# EAGLE design sc_v0 (EAGLE 6.0)
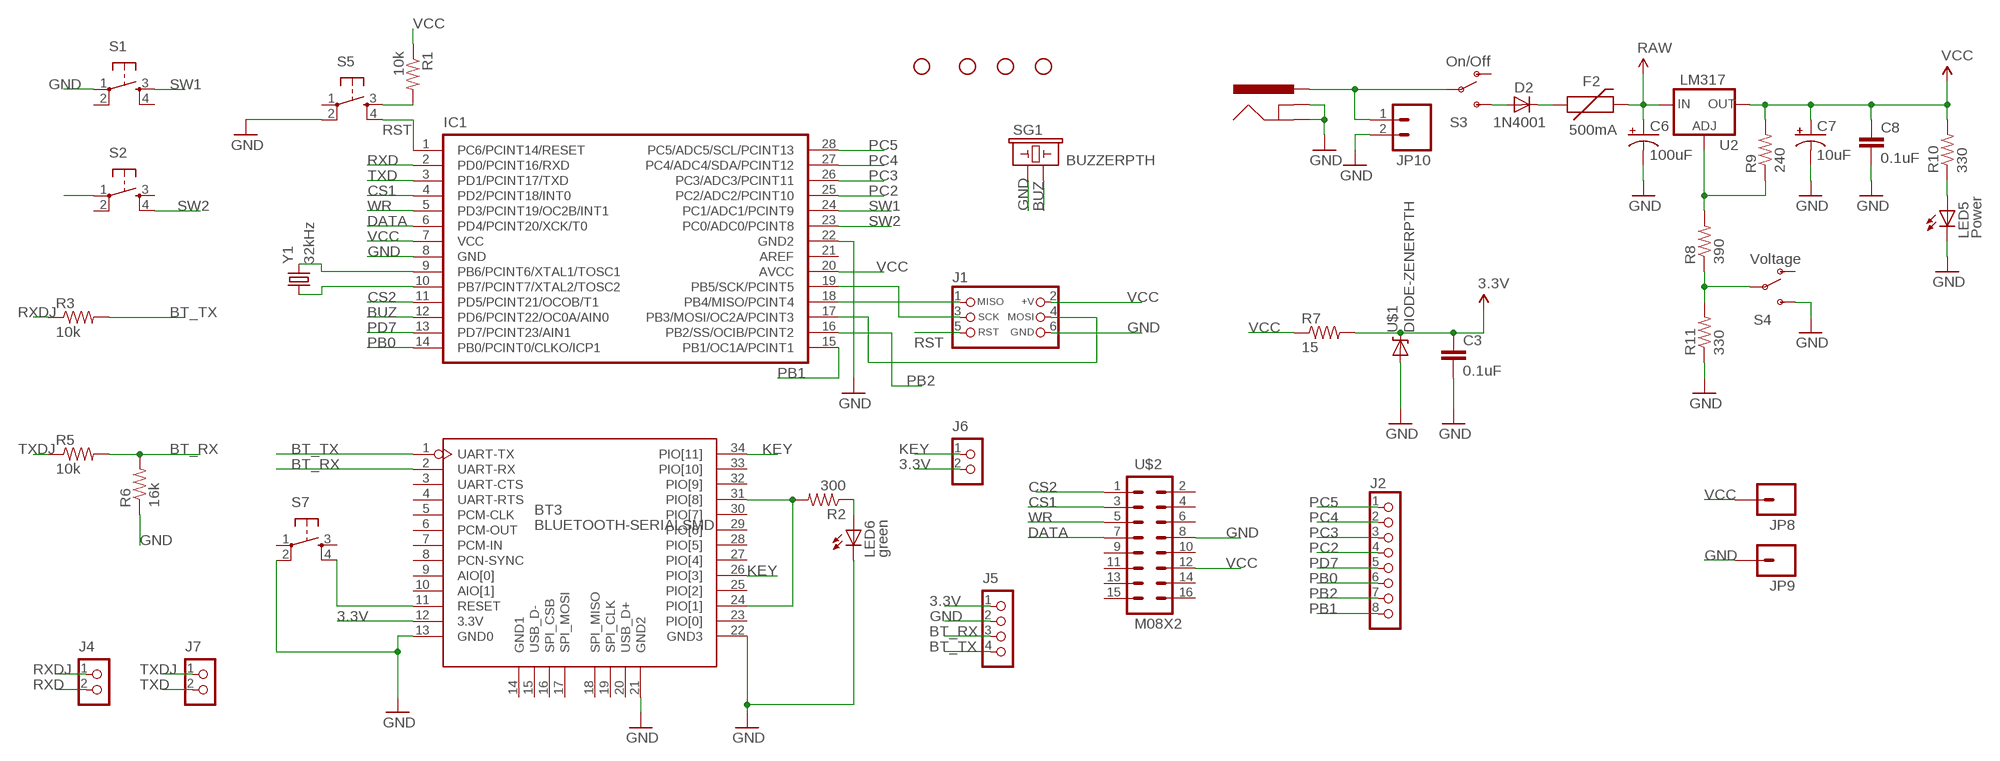
[diagram p0: schematic, sheet 1]

## Parts
BT3  BLUETOOTH-SERIALSMD  [SERIAL_BLUETEETH]
C3  0.1uF  CAPPTH2  [CAP-PTH-SMALL2]
C6  100uF  CAP_POLPTH1  [CPOL-RADIAL-100UF-25V]
C7  10uF  CAP_POLPTH2  [CPOL-RADIAL-10UF-25V]
C8  0.1uF  CAPPTH2  [CAP-PTH-SMALL2]
D2  1N4001  DIODEPTH  [DIODE-0.4]
F2  500mA  PTCPTH  [PTC]
IC1  IC_UC_ATMEGA328PDIL  [DIL28-N]
J1  CON_HEADER_PRG_AVR_ICSP  [HEADER_PRG_2X03]
J2  CON_HEADER_1X08-PTH  [M1X8]
J3  POWER_JACKPTH  [POWER_JACK_PTH]
J4  CON_HEADER_1X02-PTH  [M1X2]
J5  CON_HEADER_1X04  [M1X4]
J6  CON_HEADER_1X02-PTH  [M1X2]
J7  CON_HEADER_1X02-PTH  [M1X2]
JP1  STAND-OFF  [STAND-OFF]
JP2  STAND-OFF  [STAND-OFF]
JP3  STAND-OFF  [STAND-OFF]
JP4  STAND-OFF  [STAND-OFF]
JP8  M01PTH  [1X01]
JP9  M01PTH  [1X01]
JP10  M02PTH  [1X02]
LED5  Power  LED5MM  [LED5MM]
LED6  green  LED3MM  [LED3MM]
R1  10k  RESISTORAXIAL-0.3  [AXIAL-0.3]
R2  300  RESISTORAXIAL-0.3  [AXIAL-0.3]
R3  10k  RESISTORAXIAL-0.3  [AXIAL-0.3]
R5  10k  RESISTORAXIAL-0.3  [AXIAL-0.3]
R6  16k  RESISTORAXIAL-0.3  [AXIAL-0.3]
R7  15  RESISTORAXIAL-0.3  [AXIAL-0.3]
R8  390  RESISTORAXIAL-0.3  [AXIAL-0.3]
R9  240  RESISTORAXIAL-0.3  [AXIAL-0.3]
R10  330  RESISTORAXIAL-0.3  [AXIAL-0.3]
R11  330  RESISTORAXIAL-0.3  [AXIAL-0.3]
S1  TAC_SWITCHPTH  [TACTILE-PTH]
S2  TAC_SWITCHPTH  [TACTILE-PTH]
S3  On/Off  SWITCH-SPSTPTH  [SWITCH-SPST]
S4  Voltage  SWITCH-SPSTPTH  [SWITCH-SPST]
S5  TAC_SWITCHPTH  [TACTILE-PTH]
S7  TAC_SWITCHPTH  [TACTILE-PTH]
SG1  BUZZERPTH  [BUZZER-12MM]
U2  LM317  V_REG_317SINK  [TO220-ADJ]
U$1  DIODE-ZENERPTH  [DIODE-ZENER]
U$2  M08X2  [2X8]
Y1  32kHz  CRYSTALTC38H  [TC38H]

## Nets
3.3V: BT3.12(3.3V) C3.1 J5.1 J6.2 R7.P$2 U$1.P$1(C)
BT_RX: BT3.2(UART-RX) J5.3 R5.P$2 R6.P$2
BT_TX: BT3.1(UART-TX) J5.4 R3.P$2
BUZ: IC1.12(PD6/PCINT22/OC0A/AIN0) SG1.-
CS1: IC1.4(PD2/PCINT18/INT0) U$2.3
CS2: IC1.11(PD5/PCINT21/OCOB/T1) U$2.1
DATA: IC1.6(PD4/PCINT20/XCK/T0) U$2.7
GND: BT3.13(GND0) BT3.21(GND2) BT3.22(GND3) C3.2 C6.2(-) C7.2(-) C8.2 IC1.8(GND) IC1.22(GND2) J1.6(GND) J3.GND J3.GNDBREAK J5.2 JP9.1 JP10.2 LED5.K(C) LED6.K(C) R6.P$1 R11.P$1 S1.1 S2.1 S4.3(S) S5.2 S7.2 SG1.+ U$1.P$2(A) U$2.8
KEY: BT3.26(PIO[3]) BT3.34(PIO[11]) J6.1
N$1: IC1.9(PB6/PCINT6/XTAL1/TOSC1) Y1.2
N$2: IC1.10(PB7/PCINT7/XTAL2/TOSC2) Y1.1
N$3: IC1.18(PB4/MISO/PCINT4) J1.1(MISO)
N$4: IC1.19(PB5/SCK/PCINT5) J1.3(SCK)
N$5: IC1.17(PB3/MOSI/OC2A/PCINT3) J1.4(MOSI)
N$6: R8.P$2 R9.P$1 U2.ADJ
N$7: LED5.A R10.P$1
N$8: BT3.24(PIO[1]) BT3.31(PIO[8]) R2.P$2
N$9: D2.C F2.P$1
N$10: D2.A S3.3(S)
N$11: J3.PWR JP10.1 S3.2(P)
N$12: R8.P$1 R11.P$2 S4.2(P)
N$14: R1.P$2 S5.3
N$20: BT3.11(RESET) S7.4
N$22: LED6.A R2.P$1
PB0: IC1.14(PB0/PCINT0/CLKO/ICP1) J2.6
PB1: IC1.15(PB1/OC1A/PCINT1) J2.8
PB2: IC1.16(PB2/SS/OCIB/PCINT2) J2.7
PC2: IC1.25(PC2/ADC2/PCINT10) J2.4
PC3: IC1.26(PC3/ADC3/PCINT11) J2.3
PC4: IC1.27(PC4/ADC4/SDA/PCINT12) J2.2
PC5: IC1.28(PC5/ADC5/SCL/PCINT13) J2.1
PD7: IC1.13(PD7/PCINT23/AIN1) J2.5
RAW: C6.1(+) F2.P$2 U2.IN
RST: IC1.1(PC6/PCINT14/RESET) J1.5(RST) S5.4
RXD: IC1.2(PD0/PCINT16/RXD) J4.2
RXDJ: J4.1 R3.P$1
SW1: IC1.24(PC1/ADC1/PCINT9) S1.3
SW2: IC1.23(PC0/ADC0/PCINT8) S2.4
TXD: IC1.3(PD1/PCINT17/TXD) J7.2
TXDJ: J7.1 R5.P$1
VCC: C7.1(+) C8.1 IC1.7(VCC) IC1.20(AVCC) J1.2(+V) JP8.1 R1.P$1 R7.P$1 R9.P$2 R10.P$2 U2.OUT U$2.12
WR: IC1.5(PD3/PCINT19/OC2B/INT1) U$2.5
Unconnected: BT3.3(UART-CTS) BT3.4(UART-RTS) BT3.5(PCM-CLK) BT3.6(PCM-OUT) BT3.7(PCM-IN) BT3.8(PCN-SYNC) BT3.9(AIO[0]) BT3.10(AIO[1]) BT3.14(GND1) BT3.15(USB_D-) BT3.16(SPI_CSB) BT3.17(SPI_MOSI) BT3.18(SPI_MISO) BT3.19(SPI_CLK) BT3.20(USB_D+) BT3.23(PIO[0]) BT3.25(PIO[2]) BT3.27(PIO[4]) BT3.28(PIO[5]) BT3.29(PIO[6]) BT3.30(PIO[7]) BT3.32(PIO[9]) BT3.33(PIO[10]) IC1.21(AREF) S1.2 S1.4 S2.2 S2.3 S3.1(O) S4.1(O) S5.1 S7.1 S7.3 U$2.2 U$2.4 U$2.6 U$2.9 U$2.10 U$2.11 U$2.13 U$2.14 U$2.15 U$2.16

## Library data of the parts
BT3 = Module:BLUETOOTH-SERIAL
C3 C8 = SparkFun:CAP: Capacitor Standard 0603 ceramic capacitor, and 0.1" leaded capacitor.
C6 C7 = SparkFun:CAP_POL: Capacitor Polarized These are standard SMD and PTH capacitors. Normally 10uF, 47uF, and 100uF in electrolytic and tantalum varieties. Always verify the external diameter of the through hole cap, it varies with capacity, voltage, and manufacturer. The EIA devices should be standard.
D2 = SparkFun:DIODE: Diode These are standard reverse protection diodes and small signal diodes. SMA package can handle up to about 1A. SOD-323 can handle about 200mA. What the SOD-323 package when ordering, there are some mfgs out there that are 5-pin packages.
F2 = SparkFun:PTC: Resettable Fuse PTC Resettable Fuse. Spark Fun Electronics SKU : COM-08357
IC1 = dp_devices:IC_UC_ATMEGA328P
J1 = dp_devices:CON_HEADER_PRG_AVR_ICSP: 2x3 AVR ICSP programming header
J2 = dp_devices:CON_HEADER_1X08
J3 = SparkFun:POWER_JACK: Power Jack This is the standard 5.5mm barrel jack for power. The PTH is the most common, proven, reliable, footprint. All others are experimental. The Slot footprint only works if the mill layer is transmitted to the PCB fab house so be warned. Spark Fun Electronics SKU : PRT-00119. Mating wall wart : TOL-00298 (and others)
J4 J6 J7 = dp_devices:CON_HEADER_1X02
J5 = dp_devices:CON_HEADER_1X04
JP1-JP4 = SparkFun:STAND-OFF: Stand Off This is the mechanical footprint for a #4 phillips button head screw. Use the keepout ring to avoid running the screw head into surrounding components. SKU : PRT-00447
JP8 JP9 = SparkFun:M01: Header 1 Standard 1-pin 0.1" header. Use with straight break away headers (SKU : PRT-00116), right angle break away headers (PRT-00553), swiss pins (PRT-00743), machine pins (PRT-00117), and female headers (PRT-00115).
JP10 = SparkFun:M02: Header 2 Standard 2-pin 0.1" header. Use with straight break away headers (SKU : PRT-00116), right angle break away headers (PRT-00553), swiss pins (PRT-00743), machine pins (PRT-00117), and female headers (PRT-00115). Molex polarized connector foot print use with SKU : PRT-08233 with associated crimp pins and housings.
LED5 = SparkFun-Nate:LED
LED6 = SparkFun:LED: LEDs Standard schematic elements and footprints for 5mm, 3mm, 1206, and 0603 sized LEDs. 5mm - Spark Fun Electronics SKU : COM-00529 (and others)
R1-R3 R5-R11 = SparkFun:RESISTOR: Resistor Basic schematic elements and footprints for 0603, 1206, and PTH resistors.
S1 S2 S5 S7 = SparkFun:TAC_SWITCH: Momentary Switch Button commonly used for reset or general input. Spark Fun Electronics SKU : COM-00097
S3 S4 = SparkFun:SWITCH-SPST: SPST Switch Simple slide switch. Spark Fun Electronics SKU : COM-00102
SG1 = SparkFun:BUZZER: Buzzer 12mm Spark Fun Electronics SKU : Comp-Buzzer
U2 = SparkFun:V_REG_317: Voltage Regulator Standard LM317 adjustable voltage regulator. AOI (Adjust Output Input). Google 'LM317 Calculator' for easy to use app to get the two resistor values needed. 240/720 for 5V output. 240/390 for 3.3V output. Spark Fun Electronics SKU : COM-00527
U$1 = SparkFun:DIODE-ZENER: Zener Diode Production Part - 8199 3.4V Zener Voltage
U$2 = SparkFun:M08X2
Y1 = SparkFun:CRYSTAL: Crystals Various standard crystals. Proven footprints. Spark Fun Electronics SKU : COM-00534

## Net classes
0 default: width 0.003 mm, drill 0.254 mm, clearance 0.152 mm

## Board
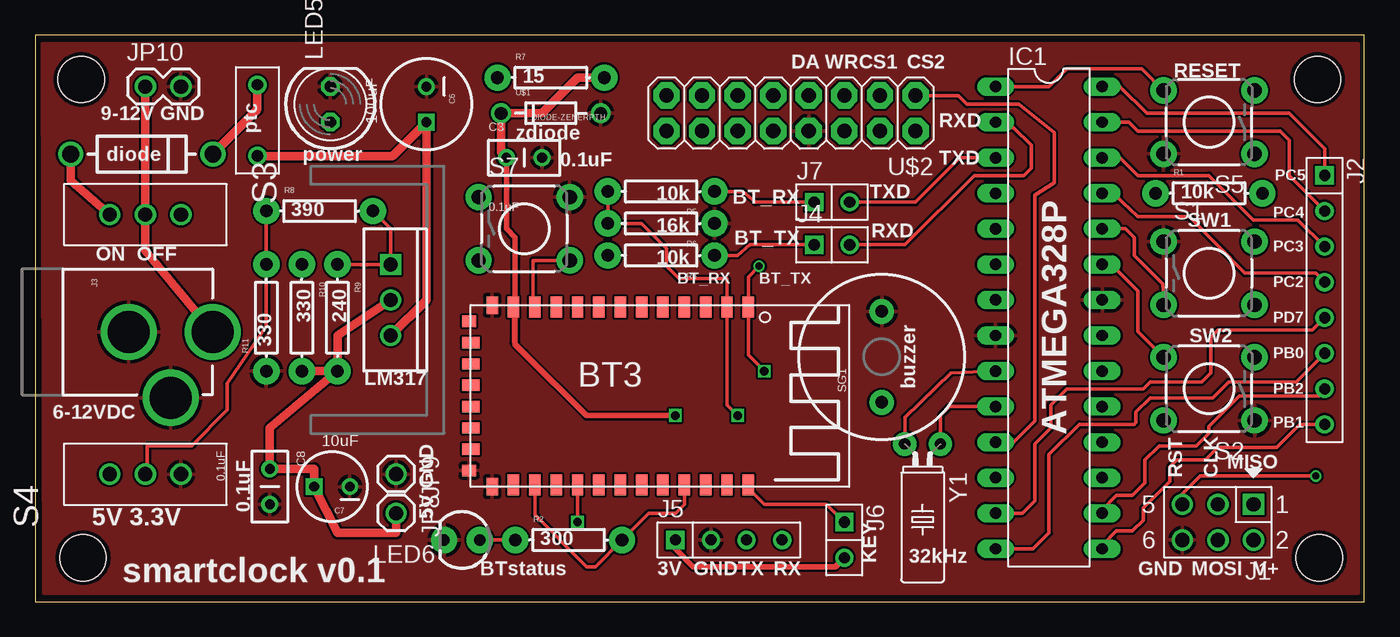
[diagram p1: board, top side]
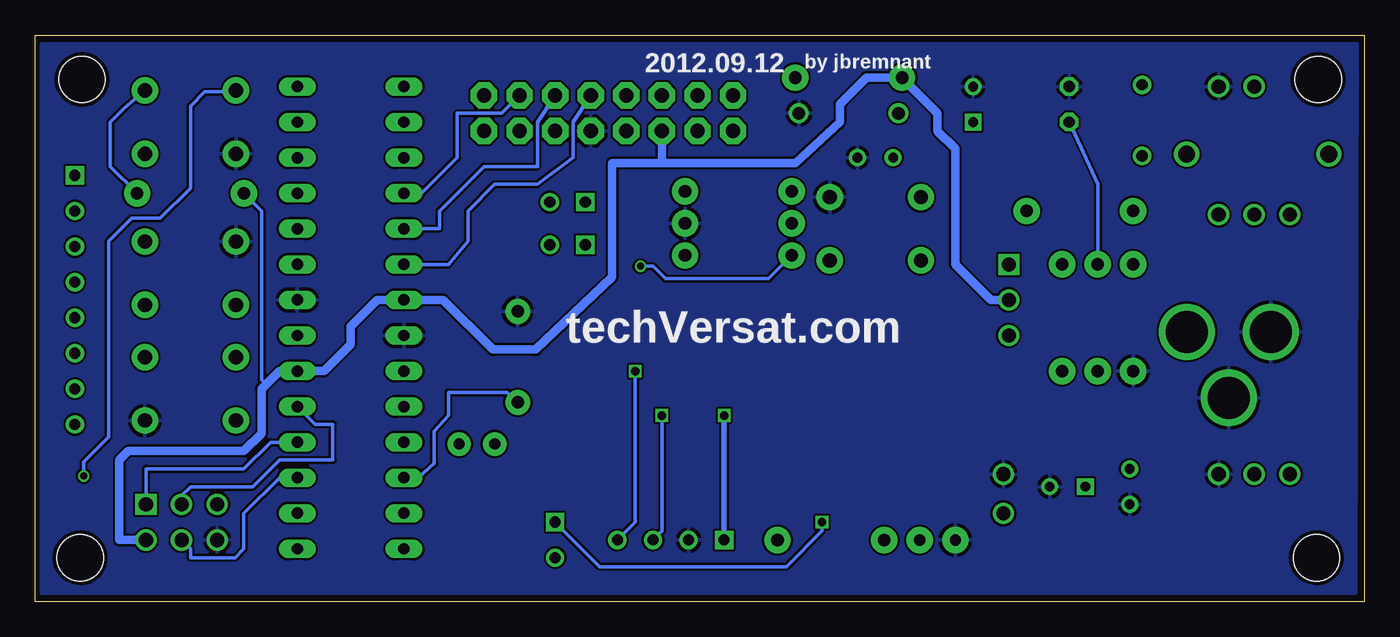
[diagram p2: board, bottom side, seen from below]

Size 94.92 x 40.49 mm. Coordinates in mm from the lower left corner, seen from the top.
Outline: 0,40.49 0,0 94.92,0 94.92,40.49 0,40.49
Copper layers (1*16): Top 0.035mm / dielectric 1.5mm / Bottom 0.035mm
Design rules: minimum track width 6mil, minimum drill 12mil, track to track 6mil, track to pad 6mil, pad to pad 6mil, via to via 6mil, smd to smd 0mil, copper to edge 10mil, drill to drill 10mil, minimum pad ring 10mil, minimum via ring 6mil, stop-mask expansion 2mil, vias tented up to drill 100mil, thermal gap 10mil

### Footprints (pad centres in the part's own frame; a part is rotated, then mirrored left to right if it is on the bottom)
SERIAL_BLUETEETH = smd 1.524 x 0.813: 1 -6.35,19.812; 2 -6.35,18.288; 3 -6.35,16.764; 4 -6.35,15.24; 5 -6.35,13.716; 6 -6.35,12.192; 7 -6.35,10.668; 8 -6.35,9.144; 9 -6.35,7.62; 10 -6.35,6.096; 11 -6.35,4.572; 12 -6.35,3.048; 23 6.35,3.048; 24 6.35,4.572; 25 6.35,6.096; 26 6.35,7.62; 27 6.35,9.144; 28 6.35,10.668; 29 6.35,12.192; 30 6.35,13.716; 31 6.35,15.24; 32 6.35,16.764; 33 6.35,18.288; 34 6.35,19.812 | smd 1.27 x 0.813: 13 -6.477,1.524; 22 6.477,1.524 | smd 0.813 x 1.016: 14 -5.334,-0.127; 21 5.334,-0.127 | smd 0.813 x 1.27: 15 -3.81,0; 16 -2.286,0; 17 -0.762,0; 18 0.762,0; 19 2.286,0; 20 3.81,0
CAP-PTH-SMALL2 = drill 0.7: 1 0,0; 2 2.54,0
CPOL-RADIAL-100UF-25V = drill 0.7 square: 1 1.27,0 | drill 0.7: 2 -1.27,0
CPOL-RADIAL-10UF-25V = drill 0.7 square: 1 1.27,0 | drill 0.7: 2 -1.27,0
DIODE-0.4 = drill 1.2: A 0,0; C 10.16,0
PTC = drill 0.8: P$1 -2.54,0; P$2 2.54,0
DIL28-N = drill 0.813 long: 1 -16.51,-3.81; 2 -13.97,-3.81; 3 -11.43,-3.81; 4 -8.89,-3.81; 5 -6.35,-3.81; 6 -3.81,-3.81; 7 -1.27,-3.81; 8 1.27,-3.81; 9 3.81,-3.81; 10 6.35,-3.81; 11 8.89,-3.81; 12 11.43,-3.81; 13 13.97,-3.81; 14 16.51,-3.81; 15 16.51,3.81; 16 13.97,3.81; 17 11.43,3.81; 18 8.89,3.81; 19 6.35,3.81; 20 3.81,3.81; 21 1.27,3.81; 22 -1.27,3.81; 23 -3.81,3.81; 24 -6.35,3.81; 25 -8.89,3.81; 26 -11.43,3.81; 27 -13.97,3.81; 28 -16.51,3.81
HEADER_PRG_2X03 = drill 1.016 square: 1 -2.54,-1.27 | drill 1.016: 2 -2.54,1.27; 3 0,-1.27; 4 0,1.27; 5 2.54,-1.27; 6 2.54,1.27
M1X8 = drill 0.8 square: 1 -8.89,0 | drill 0.8: 2 -6.35,0; 3 -3.81,0; 4 -1.27,0; 5 1.27,0; 6 3.81,0; 7 6.35,0; 8 8.89,0
POWER_JACK_PTH = drill 2.997: GND 0,7.7; GNDBREAK 4.7,10.7; PWR 0,13.7
M1X2 = drill 0.8 square: 1 -1.27,0 | drill 0.8: 2 1.27,0
M1X4 = drill 0.8 square: 1 0,0 | drill 0.8: 2 2.54,0; 3 5.08,0; 4 7.62,0
STAND-OFF = hole 3.302: 0,0
1X01 = drill 1.016: 1 0,0
1X02 = drill 1.016: 1 0,0; 2 2.54,0
LED5MM = drill 0.813 octagon: A -1.27,0; K 1.27,0
LED3MM = drill 0.813 pad 1.88: A -1.27,0; K 1.27,0
AXIAL-0.3 = drill 0.9 pad 1.88: P$1 -3.81,0; P$2 3.81,0
TACTILE-PTH = drill 1.016 pad 1.88: 1 -3.251,2.261; 2 3.251,2.261; 3 -3.251,-2.261; 4 3.251,-2.261
SWITCH-SPST = drill 1.016: 1 0,2.54; 2 0,0; 3 0,-2.54
BUZZER-12MM = drill 0.9 pad 1.778: + 3.25,0; - -3.25,0
TO220-ADJ = drill 1 square: ADJ -2.54,0 | drill 1: IN 2.54,0; OUT 0,0
DIODE-ZENER = drill 0.9: P$1 -3.556,0; P$2 3.556,0
2X8 = drill 1.016 pad 1.88 octagon: 1 0,0; 2 0,2.54; 3 2.54,0; 4 2.54,2.54; 5 5.08,0; 6 5.08,2.54; 7 7.62,0; 8 7.62,2.54; 9 10.16,0; 10 10.16,2.54; 11 12.7,0; 12 12.7,2.54; 13 15.24,0; 14 15.24,2.54; 15 17.78,0; 16 17.78,2.54
TC38H = drill 0.813 pad 1.676: 1 -1.27,0; 2 1.27,0

### Placement (x,y rotation side)
BT3  31.11,14.71 270 top
C3  33.66,31.73 0 top
C6  27.94,35.54 270 top
C7  21.21,8.24 180 top
C8  16.76,9.51 270 top
D2  2.54,31.98 0 top
F2  15.88,34.4 270 top
IC1  72.39,20.3 270 top
J1  84.45,5.7 180 top
J2  92.08,21.57 270 top
J3  -1.02,19.28 270 top
J4  56.9,25.51 0 top
J5  45.72,4.43 0 top
J6  57.78,4.43 270 top
J7  56.9,28.55 0 top
JP1  3.43,3.15 0 top
JP2  3.3,37.32 0 top
JP3  91.57,37.32 0 top
JP4  91.69,3.15 0 top
JP8  25.78,6.33 270 top
JP9  25.78,9.12 270 top
JP10  7.87,36.81 0 top
LED5  21.08,35.54 90 top
LED6  30.48,4.43 180 top
R1  83.82,29.19 0 top
R2  38.1,4.43 0 top
R3  44.7,24.75 180 top
R5  44.7,29.32 180 top
R6  44.7,27.03 180 top
R7  36.83,37.45 0 top
R8  20.32,27.92 0 top
R9  21.59,20.3 270 top
R10  19.05,20.3 270 top
R11  16.51,20.3 90 top
S1  83.82,23.48 0 top
S2  83.82,15.22 180 top
S3  7.87,27.67 270 top
S4  7.87,9.12 90 top
S5  83.82,34.27 180 top
S7  34.92,26.65 0 top
SG1  60.45,17.51 90 top
U2  25.4,21.57 270 top
U$1  36.83,34.9 0 top
U$2  62.87,36.17 180 top
Y1  63.37,11.28 180 top

### Tracks (layer width: path | path; a pad name or v marks a point on that pad's centre or on a via)
3.3V  (via drill 0.6)
  Top 0.254: BT3.12 34.16,18.52 34.92,17.76
  Top 0.406: C3.1 33.66,26.65 34.29,26.02 34.29,18.39 34.92,17.76 39.37,13.32 v45.72,13.32 | J5.1 45.72,3.79 46.99,2.52 57.15,2.52 J6.2
  Top 0.61: R7.P$2 38.73,37.45 36.2,34.9 U$1.P$1 33.27,32.11 C3.1
  Bottom 0.406: v45.72,13.32 J5.1
BT_RX  (via drill 0.6)
  Top 0.254: R5.P$2 R6.P$2 43.31,27.03 45.09,25.25 45.09,23.98 45.97,23.09 49.4,23.09 BT3.2 | BT3.2 49.4,21.44 | BT3.2 49.4,14.08 v50.16,13.32
  Bottom 0.254: v50.16,13.32 50.16,5.06 J5.3
BT_TX  (via drill 0.51, 0.6)
  Top 0.254: v52.07,16.49 50.93,17.63 BT3.1 50.93,23.22 v51.69,23.98
  Bottom 0.254: v52.07,16.49 52.07,5.7 J5.4 | v51.69,23.98 50.8,23.98 49.91,23.09 42.55,23.09 R3.P$2
BUZ
  Bottom 0.254: IC1.12 67.56,8.87 66.42,9.89 66.42,12.17 65.41,13.32 65.41,14.97 61.21,14.97 SG1.-
CS1
  Bottom 0.254: IC1.4 67.31,29.19 64.77,31.73 64.77,34.9 61.59,34.9 U$2.3
CS2
  Top 0.254: IC1.11 69.85,11.41 71.37,12.93 71.37,29.06 72.77,29.95 72.77,33.51 70.23,35.54 66.55,35.54 65.91,36.17 U$2.1
DATA
  Bottom 0.254: IC1.6 65.41,24.11 64.01,25.76 64.01,27.92 62.1,29.82 59.05,29.82 56.52,31.73 56.52,34.27 U$2.7
GND
  pour Top: 0.51,39.86 94.49,39.86 94.49,0.61 0.64,0.61
  pour Bottom: 0.51,39.86 94.49,39.86 94.49,0.61 0.64,0.61
KEY  (via drill 0.6)
  Top 0.254: BT3.34 50.93,8.11 52.07,6.97 56.52,6.97 J6.1 | BT3.26 v38.73,5.7
  Bottom 0.254: v38.73,5.7 38.73,5.06 41.27,2.52 54.61,2.52 J6.1
N$1
  Top 0.254: IC1.9 65.41,16.36 62.1,13.19 Y1.2
N$2
  Top 0.254: IC1.10 65.28,13.95 64.64,13.32 Y1.1
N$3
  Bottom 0.254: J1.1 87,9.51 80.01,9.51 78.11,11.41 IC1.18
N$4
  Bottom 0.254: J1.3 84.45,7.6 83.82,8.24 79.38,8.24 77.47,10.14 73.66,10.14 73.66,12.68 74.93,12.68 IC1.19
N$5
  Bottom 0.254: IC1.17 77.47,8.87 80.01,6.33 80.01,3.79 80.64,3.15 83.82,3.15 83.82,3.79 J1.4
N$6
  Top 0.254: R9.P$1 U2.ADJ 25.4,26.65 R8.P$2
N$7
  Bottom 0.254: LED5.A 19.05,29.82 R10.P$1
N$8
  Top 0.254: BT3.24 35.69,6.2 39.37,2.52 40.01,2.52 R2.P$2 43.81,6.33 45.72,6.33 46.35,6.97 BT3.31
N$9
  Top 0.61: F2.P$1 15.88,35.16 D2.C
N$10
  Top 0.61: D2.A 2.54,30.08 S3.3
N$11
  Top 0.61: J3.PWR 7.87,25.11 S3.2 JP10.1
N$12
  Top 0.254: R8.P$1 R11.P$2 16.51,19.66 13.72,15.6 13.72,13.7 11.18,11.16 8,11.16 8,9.25 8,9.12 | 8,9.12 8,9 | S4.2 8,9.12
N$14
  Bottom 0.254: S5.3 88.54,35.26 89.53,34.27 89.53,31.09 R1.P$2
N$20
  Top 0.254: S7.4 35.56,24.39 35.56,21.7 | 35.56,21.7 35.56,21.57 | BT3.11 35.56,21.7
N$22
  Top 0.254: LED6.A R2.P$1
PB0
  Top 0.254: IC1.14 71.25,3.79 72.39,4.93 72.39,10.52 74.55,12.68 78.49,12.68 78.61,12.81 78.61,13.57 79.63,14.59 84.07,14.59 85.22,15.73 90.04,15.73 J2.6
PB1
  Top 0.254: IC1.15 76.2,4.04 77.22,5.06 78.36,5.06 79.12,5.82 79.12,6.71 81.03,8.62 81.03,9.63 81.53,10.14 83.57,10.14 84.45,11.03 88.65,11.03 90.3,12.68 J2.8
PB2
  Top 0.254: IC1.16 76.2,6.58 77.22,7.6 78.36,7.6 79.25,8.49 79.25,10.14 80.26,11.16 82.93,11.16 83.82,12.04 83.82,12.55 85.98,14.71 91.69,14.71 92.2,15.22 J2.7
PC2
  Top 0.254: IC1.25 77.09,29.06 78.74,27.54 82.42,27.54 86.36,23.48 91.44,23.48 J2.4
PC3
  Top 0.254: IC1.26 77.47,31.73 78.74,30.46 83.82,30.46 87,27.29 90.17,27.29 J2.3
PC4
  Top 0.254: IC1.27 78.11,34.27 78.74,33.63 88.9,33.63 89.53,33 89.53,30.46 J2.2
PC5
  Top 0.254: IC1.28 77.47,36.81 79.38,34.9 89.53,34.9 92.08,32.36 J2.1
PD7
  Top 0.254: IC1.13 70.48,6.33 71.37,7.22 71.37,11.28 72.52,12.43 72.52,14.08 73.66,15.22 79.12,15.22 79.63,15.73 83.31,15.73 83.95,16.36 83.95,18.9 84.45,19.41 91.19,19.41 J2.5
RAW
  Top 0.61: F2.P$2 25.53,31.86 C6.1 27.94,21.57 U2.IN
RST  (via drill 0.51)
  Top 0.254: IC1.1 72.39,36.81 73.66,38.08 79.02,38.08 S5.4 | J1.5 81.92,7.73 83.19,9 v91.44,9
  Bottom 0.254: v91.44,9 91.44,10.01 89.66,11.79 89.66,25.76 88.01,27.41 85.98,27.41 83.82,29.57 83.82,35.41 82.8,36.43 80.64,36.43 80.64,36.45 S5.4
RXD
  Top 0.254: J4.2 62.1,25.51 67.06,30.46 70.61,30.46 71.12,30.97 71.12,32.62 69.85,33.89 68.96,33.89 IC1.2
RXDJ
  Top 0.254: J4.1 51.05,25.51 50.16,24.75 R3.P$1
SW1
  Top 0.254: IC1.24 77.85,26.65 78.49,26.02 78.49,24.75 80.52,22.71 80.64,21.29 S1.3
SW2
  Top 0.254: IC1.23 76.83,24.11 78.74,22.21 78.74,19.31 S2.4
TXD
  Top 0.254: J7.2 62.87,28.55 66.04,31.73 IC1.3
TXDJ
  Top 0.254: J7.1 51.44,28.55 50.55,29.32 R5.P$1
VCC
  Top 0.61: U2.OUT 21.59,19.03 R9.P$2 | R9.P$2 16.76,12.43 C8.1 19.94,9.51 C7.1 21.59,4.93 25.78,4.93 JP8.1 | R10.P$2 R9.P$2
  Bottom 0.254: R1.P$1 78.74,27.92 78.74,15.86 78.42,15.54
  Bottom 0.61: U2.OUT 26.67,21.57 29.21,24.11 29.21,32.36 30.48,33.63 30.48,34.9 R7.P$1 35.56,37.45 37.47,35.54 37.47,34.27 40.64,31.35 50.16,31.35 | 50.16,31.35 U$2.12 | J1.2 88.9,4.43 88.9,10.14 88.27,10.78 80.01,10.78 78.74,12.04 78.74,15.22 78.42,15.54 77.47,16.49 IC1.20 74.3,16.49 72.39,18.39 72.39,19.66 70.48,21.57 IC1.7 65.79,21.57 62.23,18.01 59.18,18.01 53.72,23.22 53.72,31.35 50.16,31.35
WR
  Bottom 0.254: IC1.5 66.04,26.65 66.04,27.92 62.87,31.09 59.05,31.09 59.05,34.27 U$2.5

### Text on the board
tPlace: DA | WR | CS1 | CS2 | RESET | ptc | 9-12V GND | RXD | power | zdiode | diode | 0.1uF | TXD | PC5 | TXD | ATMEGA328P | BT_RX | SW1 | PC4 | BT_TX | RXD | PC3 | ON OFF | BT_RX | BT_TX | PC2 | PD7 | SW2 | LM317 | PB0 | buzzer | PB2 | 6-12VDC | PB1 | 0.1uF | MISO | RST | CLK | 5V GND | KEY | 5V 3.3V | 32kHz | BTstatus | 3V | GND | TX | RX | GND | MOSI | V+ | smartclock v0.1
bPlace: 2012.09.12 | by jbremnant | techVersat.com